# Altium schematic sheet GateDriverAndPowerDevices.SchDoc: Gate driver and power devices schematic
size A4
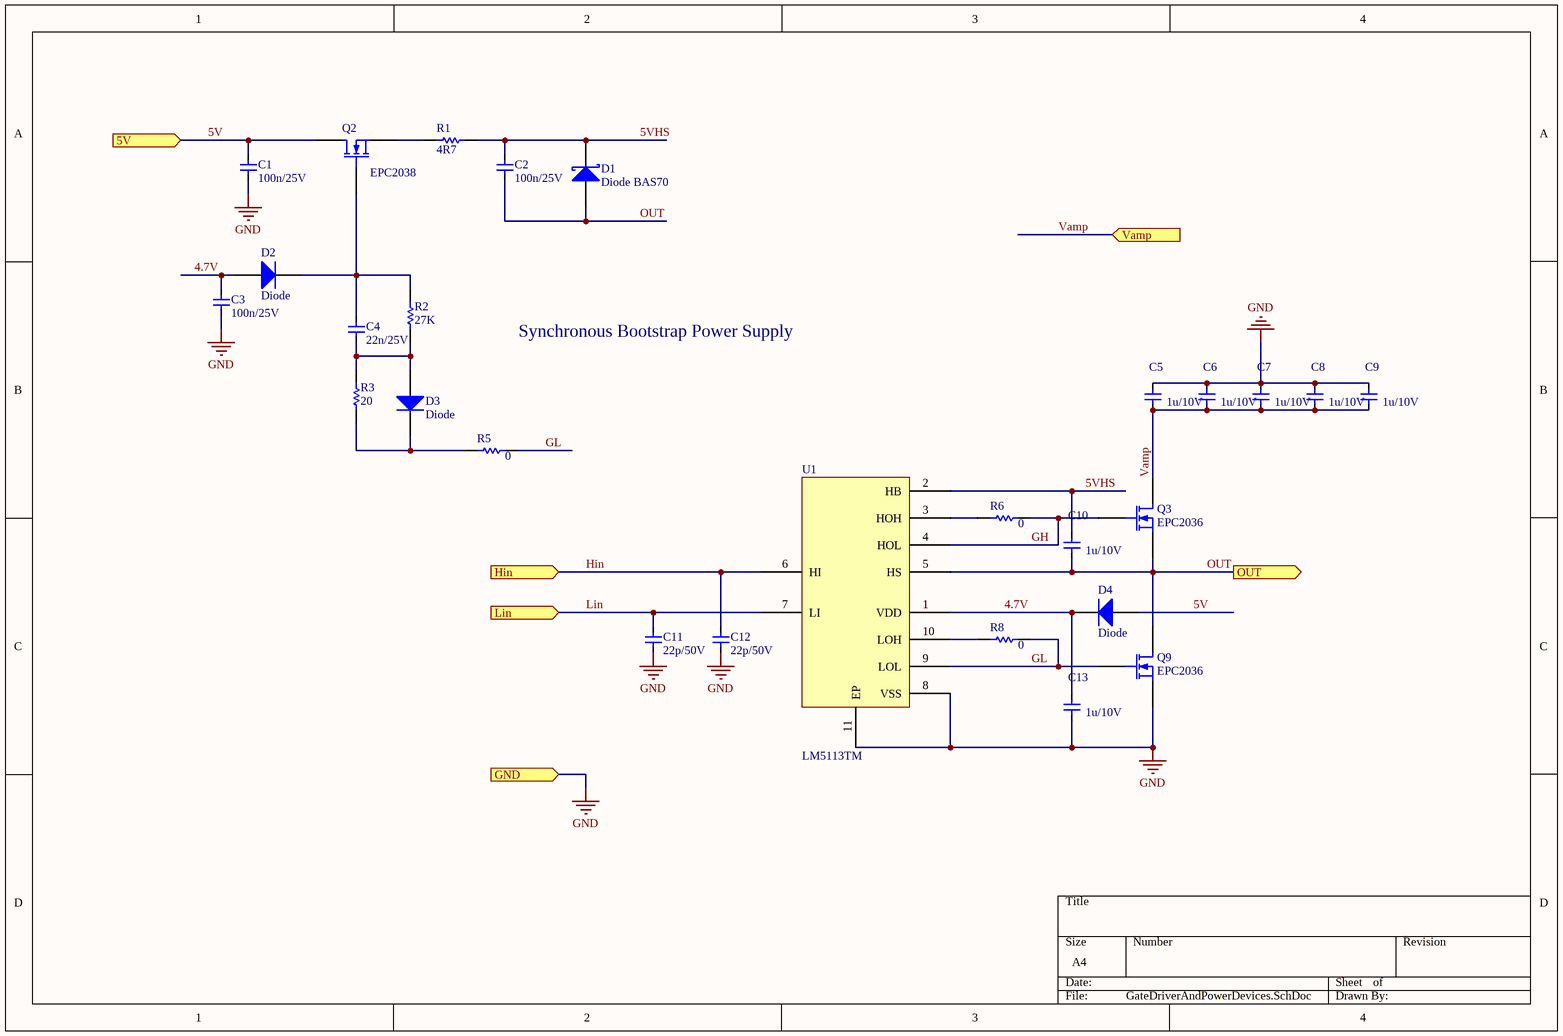
[diagram p0: GateDriverAndPowerDevices.SchDoc]

## Parts
C1  100n/25V  [0603]
C2  100n/25V  [0603]
C3  100n/25V  [0603]
C4  22n/25V  [0603]
C5  1u/10V  [0603]
C6  1u/10V  [0603]
C7  1u/10V  [0603]
C8  1u/10V  [0603]
C9  1u/10V  [0603]
C10  1u/10V  [0603]
C11  22p/50V  [0603]
C12  22p/50V  [0603]
C13  1u/10V  [0603]
D1  Diode BAS70  [SMA]
D2  Diode  [SMA]
D3  Diode  [SMA]
D4  Diode  [SMA]
Q2  EPC2038  [BGA100P9X9-81A]
Q3  EPC2036  [BGA100P9X9-81A]
Q9  EPC2036  [BGA100P9X9-81A]
R1  value 4R7  [0603]  (hidden comment: Res1)
R2  value 27K  [0603]  (hidden comment: Res1)
R3  value 20  [0603]  (hidden comment: Res1)
R5  value 0  [0603]  (hidden comment: Res1)
R6  value 0  [0402]  (hidden comment: Res1)
R8  value 0  [0402]  (hidden comment: Res1)
U1  LM5113TM  [QFN80P400X400X80-10N]

## Ports
5V (in), GND (in), Hin (in), Lin (in), OUT (out), Vamp (in)

## Nets
GND: C1.2 C3.2 C5.1 C6.1 C7.1 C8.1 C9.1 C11.2 C12.2 C13.2 Q9.3(S) U1.8(VSS) U1.11(EP) ; port GND
4.7V: C3.1 C13.1 D2.1(A) D4.2(K) U1.1(VDD)
5V: C1.1 D4.1(A) Q2.1(D) ; port 5V
5VHS: C2.1 C10.1 D1.3(K) R1.1 U1.2(HB)
GH: Q3.2(G) R6.2 U1.4(HOL)
GL: Q9.2(G) R5.2 R8.2 U1.9(LOL)
Hin: C12.1 U1.6(HI) ; port Hin
Lin: C11.1 U1.7(LI) ; port Lin
OUT: C2.2 C10.2 D1.1(A) Q3.3(S) Q9.1(D) U1.5(HS) ; port OUT
Vamp: C5.2 C6.2 C7.2 C8.2 C9.2 Q3.1(D) ; port Vamp
NetC4_1: C4.1 D2.2(K) Q2.2(G) R2.2
NetC4_2: C4.2 D3.1(A) R2.1 R3.2
NetD3_2: D3.2(K) R3.1 R5.1
NetQ2_3: Q2.3(S) R1.2
NetR6_1: R6.1 U1.3(HOH)
NetR8_1: R8.1 U1.10(LOH)

## Notes on the sheet
- Synchronous Bootstrap Power Supply

## Library data of the parts
C1-C13 = CAP1: Capacitor
D1 = Diode BAS70: Silicon AF Schottky Diode for High-Speed Switching; pin to pad: 3>2; Note: Pin 2 is not connected and not drawn.; Published: 21-Mar-2003; LatestRevisionDate: 29-May-2009; LatestRevisionNote: IPC-7351 Footprint Added.; DatasheetVersion: Oct-1999; PackageVersion: Sep-2001; PackageReference: SOT-23; Publisher: Altium Limited; PackageDescription: 3-Pin SOT-23 Package 0.95 mm Pitch, 2.5 mm Lead Span; ComponentLink1Description: Manufacturer Link; ComponentLink1URL: http://www.infineon.com/; ComponentLink2Description: Datasheet; ComponentLink2URL: http://www.infineon.com/upload/Document/cmc_upload/documents/009/382/bas40_bas140series_1.pdf
D2-D4 = Diode: Default Diode; Published: 8-Jun-2000; LatestRevisionDate: 17-Jul-2002; LatestRevisionNote: Re-released for DXP Platform.; PackageVersion: Sep-1996; PackageReference: SMC; Publisher: Altium Limited; PackageDescription: DO-214-AB/SMC; 2 C-Bend Leads; Body 7.9 x 5.9 mm, inc. leads (LxW); Code_JEDEC: DO-214-AB
Q2 Q3 Q9 = MOSFET-N: N-Channel MOSFET; Published: 8-Jun-2000; LatestRevisionDate: 17-Jul-2002; LatestRevisionNote: Re-released for DXP Platform.; PackageVersion: 1995/1996; PackageReference: E3; Publisher: Altium Limited; PackageDescription: TO, Flat Index; 3 In-Line, Axial Leads; Body Dia. 4.6mm; Lead Dia. 0.5 mm (max)
R1-R3 R5 R6 R8 = Res1: Resistor; Published: 8-Jun-2000; LatestRevisionDate: 17-Jul-2002; LatestRevisionNote: Re-released for DXP Platform.; PackageReference: AXIAL-0.3; Publisher: Altium Limited; PackageDescription: Axial Device, Thru-Hole; 2 Leads; 0.3 in Pin Spacing